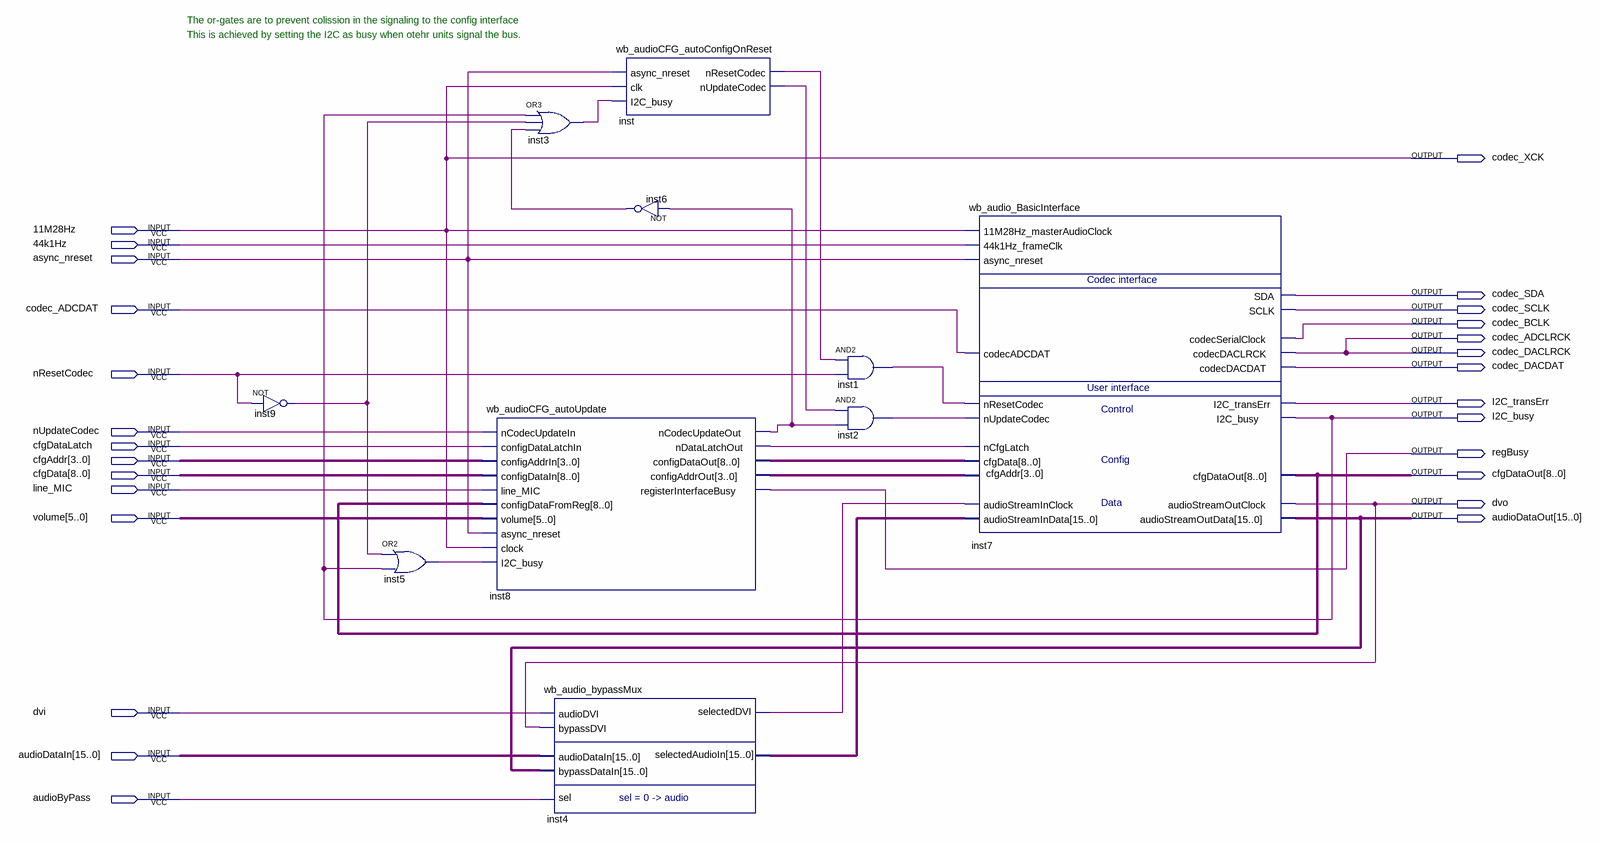
[diagram p0: schematic sheet]
// Quartus schematic wb_audio_AdvInterface.bdf as structural Verilog: 10 symbols, 27 pins
module wb_audio_AdvInterface (
  input  \11M28Hz ,
  input  \44k1Hz ,
  input  async_nreset,
  input  codec_ADCDAT,
  input  nResetCodec,
  input  nUpdateCodec,
  input  cfgDataLatch,
  input  [3:0] cfgAddr,
  input  [8:0] cfgData,
  input  line_MIC,
  input  [5:0] volume,
  input  dvi,
  input  [15:0] audioDataIn,
  input  audioByPass,
  output codec_XCK,
  output codec_SDA,
  output codec_SCLK,
  output codec_BCLK,
  output codec_ADCLRCK,
  output codec_DACLRCK,
  output codec_DACDAT,
  output I2C_transErr,
  output I2C_busy,
  output regBusy,
  output [8:0] cfgDataOut,
  output dvo,
  output [15:0] audioDataOut
);

  wire inst1_out, inst2_out, inst3_out, inst4_selecteddvi, inst5_out, inst6_out, inst8_ncodecupdateout,
       inst8_ndatalatchout, inst9_out, inst_nresetcodec, inst_nupdatecodec;
  wire [3:0] inst8_configaddrout;
  wire [8:0] inst8_configdataout;
  wire [15:0] inst4_selectedaudioin;

  not inst9 (inst9_out, nResetCodec);
  or inst5 (inst5_out, inst9_out, I2C_busy);
  wb_audioCFG_autoUpdate inst8 (
    .nCodecUpdateIn(nUpdateCodec), .configDataLatchIn(cfgDataLatch), .configAddrIn(cfgAddr),
    .configDataIn(cfgData), .line_MIC(line_MIC), .configDataFromReg(cfgDataOut), .volume(volume),
    .async_nreset(async_nreset), .clock(\11M28Hz ), .I2C_busy(inst5_out),
    .nCodecUpdateOut(inst8_ncodecupdateout), .nDataLatchOut(inst8_ndatalatchout),
    .configDataOut(inst8_configdataout), .configAddrOut(inst8_configaddrout), .registerInterfaceBusy(regBusy));
  or inst3 (inst3_out, I2C_busy, inst9_out, inst6_out);
  wb_audio_bypassMux inst4 (
    .audioDVI(dvi), .bypassDVI(dvo), .audioDataIn(audioDataIn), .bypassDataIn(audioDataOut),
    .sel(audioByPass), .selectedDVI(inst4_selecteddvi), .selectedAudioIn(inst4_selectedaudioin));
  wb_audioCFG_autoConfigOnReset inst (
    .async_nreset(async_nreset), .clk(\11M28Hz ), .I2C_busy(inst3_out), .nResetCodec(inst_nresetcodec),
    .nUpdateCodec(inst_nupdatecodec));
  not inst6 (inst6_out, inst8_ncodecupdateout);
  and inst1 (inst1_out, inst_nresetcodec, nResetCodec);
  and inst2 (inst2_out, inst_nupdatecodec, inst8_ncodecupdateout);
  wb_audio_BasicInterface inst7 (
    .\11M28Hz_masterAudioClock (\11M28Hz ), .\44k1Hz_frameClk (\44k1Hz ), .async_nreset(async_nreset),
    .nResetCodec(inst1_out), .nUpdateCodec(inst2_out), .cfgData(inst8_configdataout),
    .cfgAddr(inst8_configaddrout), .nCfgLatch(inst8_ndatalatchout),
    .audioStreamInData(inst4_selectedaudioin), .audioStreamInClock(inst4_selecteddvi),
    .codecADCDAT(codec_ADCDAT), .SCLK(codec_SCLK), .I2C_transErr(I2C_transErr), .cfgDataOut(cfgDataOut),
    .codecSerialClock(codec_BCLK), .codecDACLRCK(codec_ADCLRCK), .codecDACDAT(codec_DACDAT),
    .audioStreamOutData(audioDataOut), .audioStreamOutClock(dvo), .I2C_busy(I2C_busy), .SDA(codec_SDA));

  assign codec_DACLRCK = codec_ADCLRCK;
  assign codec_XCK = \11M28Hz ;

  // Notes on the sheet:
  //   The or-gates are to prevent colission in the signaling to the config interface
  //   This is achieved by setting the I2C as busy when otehr units signal the bus.
endmodule
